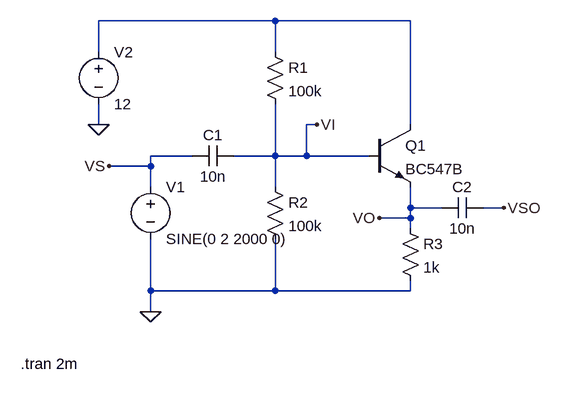
[diagram p0: schematic emitter_follower.asc]
emitter_follower.asc, the LTspice schematic file:
Version 4
SHEET 1 880 680
WIRE 352 80 80 80
WIRE 560 80 352 80
WIRE 80 128 80 80
WIRE 352 128 352 80
WIRE 80 240 80 208
WIRE 416 240 400 240
WIRE 560 240 560 80
WIRE 400 288 400 240
WIRE 224 288 160 288
WIRE 352 288 352 208
WIRE 352 288 288 288
WIRE 400 288 352 288
WIRE 496 288 400 288
WIRE 160 304 160 288
WIRE 160 304 96 304
WIRE 160 336 160 304
WIRE 352 336 352 288
WIRE 560 368 560 336
WIRE 608 368 560 368
WIRE 704 368 672 368
WIRE 560 384 560 368
WIRE 560 384 512 384
WIRE 560 400 560 384
WIRE 160 496 160 416
WIRE 352 496 352 416
WIRE 352 496 160 496
WIRE 560 496 560 480
WIRE 560 496 352 496
WIRE 160 528 160 496
FLAG 160 528 0
FLAG 80 240 0
FLAG 704 368 VSO
FLAG 96 304 VS
FLAG 416 240 VI
FLAG 512 384 VO
SYMBOL Voltage 160 320 R0
SYMATTR InstName V1
SYMATTR Value SINE(0 2 2000 0)
SYMBOL Voltage 80 112 R0
SYMATTR InstName V2
SYMATTR Value 12
SYMBOL npn 496 240 R0
SYMATTR InstName Q1
SYMATTR Value BC547B
SYMBOL Res 336 112 R0
SYMATTR InstName R1
SYMATTR Value 100k
SYMBOL Res 336 320 R0
SYMATTR InstName R2
SYMATTR Value 100k
SYMBOL Res 544 384 R0
SYMATTR InstName R3
SYMATTR Value 1k
SYMBOL Cap 288 272 R90
WINDOW 0 0 32 VBottom 2
WINDOW 3 32 32 VTop 2
SYMATTR InstName C1
SYMATTR Value 10n
SYMBOL Cap 672 352 R90
WINDOW 0 0 32 VBottom 2
WINDOW 3 32 32 VTop 2
SYMATTR InstName C2
SYMATTR Value 10n
TEXT -40 608 Left 2 !.tran 2m

The netlist it stands for:
* emitter_follower.asc
V1 VS 0 SINE(0 2 2000 0)
V2 N001 0 12
Q1 N001 VI VO 0 BC547B
R1 N001 VI 100k
R2 VI 0 100k
R3 VO 0 1k
C1 VI VS 10n
C2 VSO VO 10n
.model NPN NPN
.model PNP PNP
.lib standard.bjt
.tran 2m
.backanno
.end